# EasyEDA Pro project 2022-4T-MNT-1.eprj

# Schematic EDA-TEST1
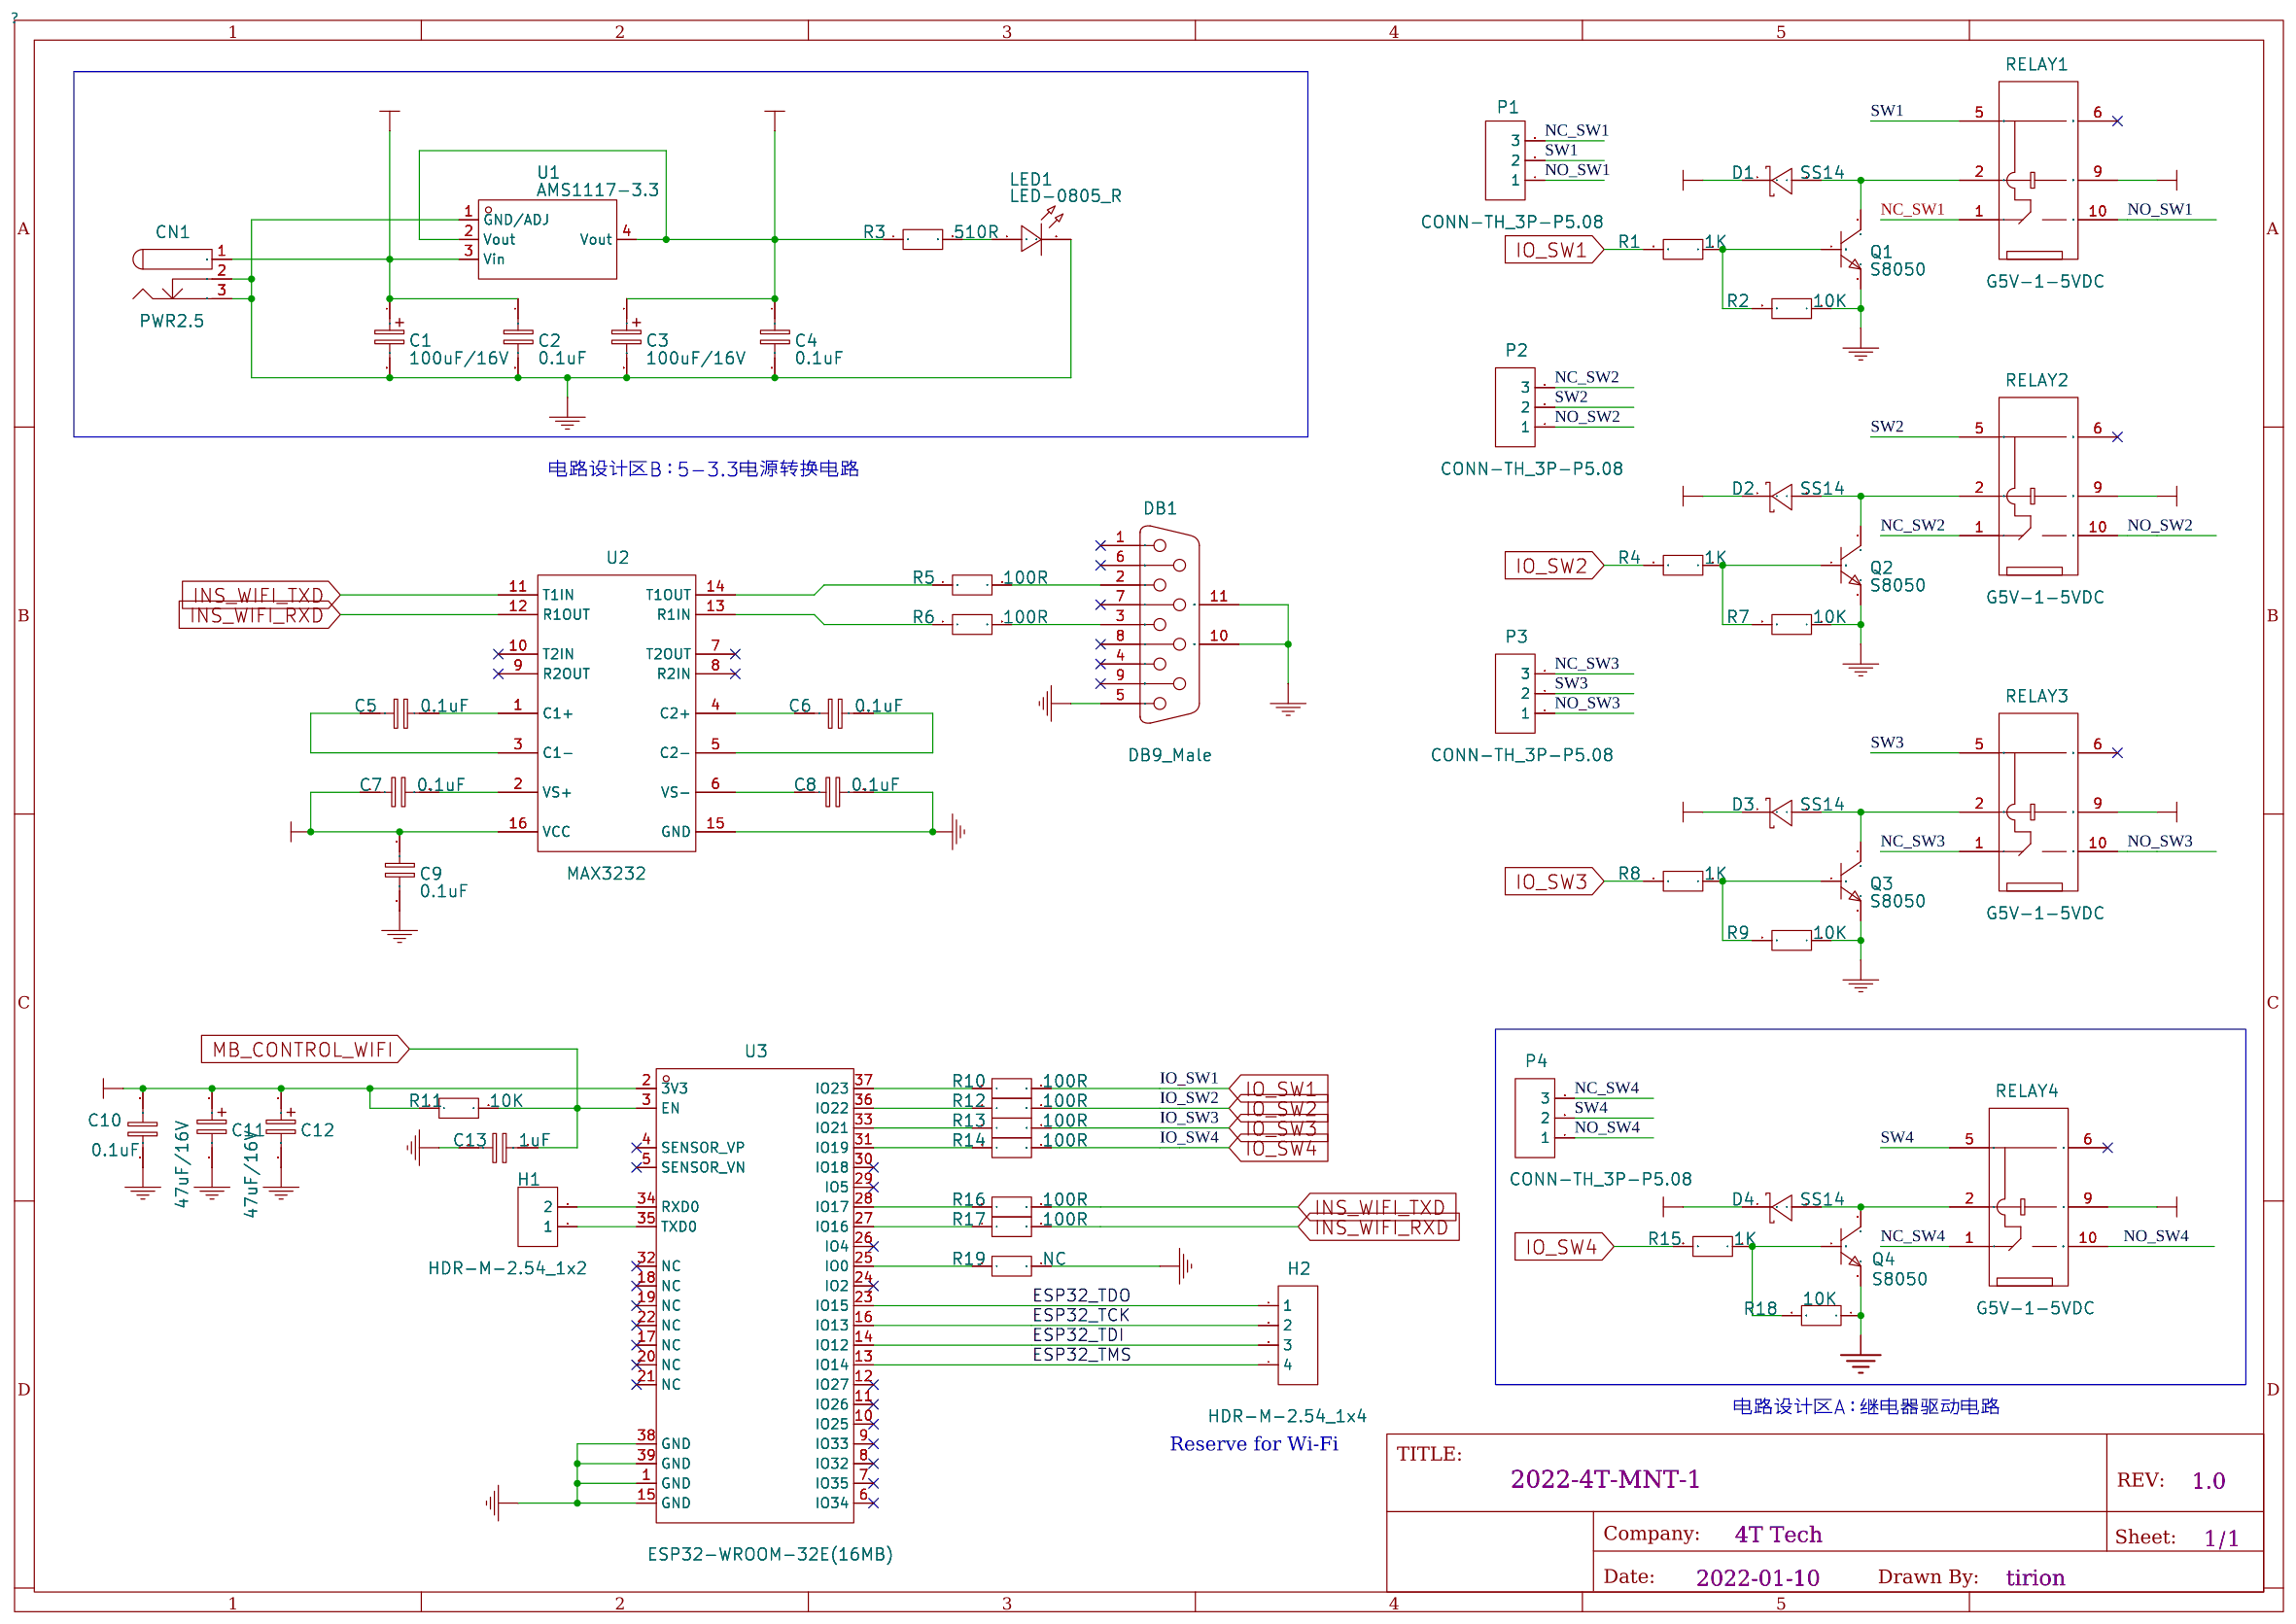
[diagram p0: schematic sheet]

## Parts
C1  100uF/16V  [C_CAP-6*H]
C2  0.1uF  [C0805]
C3  100uF/16V  [C_CAP-6*H]
C4  0.1uF  [C0805]
C5  0.1uF  [C0805]
C6  0.1uF  [C0805]
C7  0.1uF  [C0805]
C8  0.1uF  [C0805]
C9  0.1uF  [C0805]
C10  0.1uF  [C0805]
C11  47uF/16V  [CAP-5X7]
C12  47uF/16V  [CAP-5X7]
C13  1uF  [C0805]
CN1  PWR2.5  [PWR2.5]
D1  SS14  [SMA_L4.4-W2.8-LS5.4-RD]
D2  SS14  [SMA_L4.4-W2.8-LS5.4-RD]
D3  SS14  [SMA_L4.4-W2.8-LS5.4-RD]
D4  SS14  [SMA_L4.4-W2.8-LS5.4-RD]
DB1  DB9_Male  [DSUB-TH_DMR-9P]
H1  HDR-M-2.54_1x2  [HDR-M-2.54_1X2]
H2  HDR-M-2.54_1x4  [HDR-M-2.54_1X4]
LED1  LED-0805_R  [LED0805_RED]
P1  CONN-TH_3P-P5.08  [CONN-TH_3P-P5.08]
P2  CONN-TH_3P-P5.08  [CONN-TH_3P-P5.08]
P3  CONN-TH_3P-P5.08  [CONN-TH_3P-P5.08]
P4  CONN-TH_3P-P5.08  [CONN-TH_3P-P5.08]
Q1  S8050  [SOT-23-3_L2.9-W1.3-P1.90-LS2.4-BR]
Q2  S8050  [SOT-23-3_L2.9-W1.3-P1.90-LS2.4-BR]
Q3  S8050  [SOT-23-3_L2.9-W1.3-P1.90-LS2.4-BR]
Q4  S8050  [SOT-23-3_L2.9-W1.3-P1.90-LS2.4-BR]
R1  1K  [R0805]
R2  10K  [R0805]
R3  510R  [R0805]
R4  1K  [R0805]
R5  100R  [R0805]
R6  100R  [R0805]
R7  10K  [R0805]
R8  1K  [R0805]
R9  10K  [R0805]
R10  100R  [R0805]
R11  10K  [R0805]
R12  100R  [R0805]
R13  100R  [R0805]
R14  100R  [R0805]
R15  1K  [R0805]
R16  100R  [R0805]
R17  100R  [R0805]
R18  10K  [R0805]
R19  NC  [R0805]
RELAY1  G5V-1-5VDC  [RELAY-TH_G5V-1]
RELAY2  G5V-1-5VDC  [RELAY-TH_G5V-1]
RELAY3  G5V-1-5VDC  [RELAY-TH_G5V-1]
RELAY4  G5V-1-5VDC  [RELAY-TH_G5V-1]
U1  AMS1117-3.3  [SOP-SOT-223]
U2  MAX3232  [SOIC-16_150MIL]
U3  ESP32-WROOM-32E(16MB)  [WIFI-SMD_ESP32-WROOM-32E]

## Library data of the parts
C1 C3 = 100uF/16V
C2 C4-C10 = 0.1uF
C11 C12 = 47uF/16V
C13 = 1uF
CN1 = PWR2.5
D1-D4 = SS14: Supplier: LCSC; Manufacturer: MDD; Supplier Part: C2480; JLCPCB Part Class: Basic Part
DB1 = DB9_Male: Supplier Part: C185657; Supplier: LCSC; Manufacturer: Amphenol
H1 = HDR-M-2.54_1x2: Supplier Part: C124375; Supplier: LCSC
H2 = HDR-M-2.54_1x4: Supplier Part: C124378; Supplier: LCSC
LED1 = 17-21SURC/S530-A3/TR8: Manufacturer: EVERLIGHT(台湾亿光); Supplier Part: C72037
P1-P4 = CONN-TH_3P-P5.08: Supplier: LCSC
Q1-Q4 = S8050: Supplier: LCSC; Supplier Part: C916390; Manufacturer: JSMSEMI; JLCPCB Part Class: Extended Part
R1 R4 R8 R15 = 1K
R2 R7 R9 R11 R18 = 10K
R3 = 510R
R5 R6 R10 R12-R14 R16 R17 = 100R
R19 = NC
RELAY1-RELAY4 = G5V-1-5VDC: Supplier: LCSC; Manufacturer: OMRON; Supplier Part: C28695; JLCPCB Part Class: Extended Part
U1 = AMS1117-3.3: Supplier: LCSC; Manufacturer: AMS; image: //image.lceda.cn/szlcsc/C6186.jpg; Supplier Part: C6186; JLCPCB Part Class: Basic; JLCPCB SMD: Yes
U2 = MAX3232: Supplier: LCSC; Manufacturer: TI; JLCPCB Part Class: Extend
U3 = ESP32-WROOM-32E(16MB): Supplier: LCSC; Supplier Part: C701343; Manufacturer: Espressif Systems; JLCPCB Part Class: Extended Part

## Nets
+3V3: C3.1 C4.1 C7.1 C9.1 C10.2 C11.1 C12.1 R3.1 R11.1 U1.2(Vout) U1.4(Vout) U2.16(VCC) U3.2(3V3)
+5V: C1.1 C2.1 CN1.1(ADJ) D1.1(K) D2.1(K) D3.1(K) D4.1(K) RELAY1.9 RELAY2.9 RELAY3.9 RELAY4.9 U1.3(Vin)
GND: C1.2 C2.2 C3.2 C4.2 C8.2 C9.2 C10.1 C11.2 C12.2 C13.2 CN1.2(ADJ) CN1.3(ADJ) DB1.5 DB1.10(MH1) DB1.11(MH2) LED1.2 Q1.2(E) Q2.2(E) Q3.2(E) Q4.2(E) R2.1 R7.1 R9.1 R18.1 R19.2 U1.1(GND/ADJ) U2.15(GND) U3.1(GND) U3.15(GND) U3.38(GND) U3.39(GND)
ESP32_TCK: H2.2 U3.16(IO13)
ESP32_TDI: H2.3 U3.14(IO12)
ESP32_TDO: H2.1 U3.23(IO15)
ESP32_TMS: H2.4 U3.13(IO14)
INS_WIFI_RXD: R17.2 U2.12(R1OUT)
INS_WIFI_TXD: R16.2 U2.11(T1IN)
IO_SW1: R1.2 R10.2
IO_SW2: R4.2 R12.2
IO_SW3: R8.2 R13.2
IO_SW4: R14.2 R15.2
MB_CONTROL_WIFI: C13.1 R11.2 U3.3(EN)
NC_SW1: P1.3 RELAY1.1
NC_SW2: P2.3 RELAY2.1
NC_SW3: P3.3 RELAY3.1
NC_SW4: P4.3 RELAY4.1
NO_SW1: P1.1 RELAY1.10
NO_SW2: P2.1 RELAY2.10
NO_SW3: P3.1 RELAY3.10
NO_SW4: P4.1 RELAY4.10
SW1: P1.2 RELAY1.5
SW2: P2.2 RELAY2.5
SW3: P3.2 RELAY3.5
SW4: P4.2 RELAY4.5
$1N65: R19.1 U3.25(IO0)
$1N108: H1.1 U3.35(TXD0)
$1N109: H1.2 U3.34(RXD0)
$1N160: D1.2(A) Q1.3(C) RELAY1.2
$1N192: Q1.1(B) R1.1 R2.2
$1N267: R10.1 U3.37(IO23)
$1N268: R12.1 U3.36(IO22)
$1N269: R13.1 U3.33(IO21)
$1N270: R14.1 U3.31(IO19)
$1N321: D2.2(A) Q2.3(C) RELAY2.2
$1N337: Q2.1(B) R4.1 R7.2
$1N397: D3.2(A) Q3.3(C) RELAY3.2
$1N413: Q3.1(B) R8.1 R9.2
$1N473: C5.1 U2.1(C1+)
$1N474: C5.2 U2.3(C1-)
$1N484: C6.2 U2.4(C2+)
$1N485: C6.1 U2.5(C2-)
$1N486: R16.1 U3.28(IO17)
$1N487: R17.1 U3.27(IO16)
$1N538: C7.2 U2.2(VS+)
$1N554: C8.1 U2.6(VS-)
$1N573: DB1.2 R5.2
$1N574: DB1.3 R6.2
$1N575: R5.1 U2.14(T1OUT)
$1N576: R6.1 U2.13(R1IN)
$1N1782: D4.2(A) Q4.3(C) RELAY4.2
$1N1818: Q4.1(B) R15.1 R18.2
$1N1835: LED1.1 R3.2

Not connected (* = marked no-connect by the designer): DB1 1* 4* 6* 7* 8* 9*; RELAY1 6*; RELAY2 6*; RELAY3 6*; RELAY4 6*; U2 7(T2OUT)* 8(R2IN)* 9(R2OUT)* 10(T2IN)*; U3 4(SENSOR_VP)* 5(SENSOR_VN)* 6(IO34)* 7(IO35)* 8(IO32)* 9(IO33)* 10(IO25)* 11(IO26)* 12(IO27)* 17(NC)* 18(NC)* 19(NC)* 20(NC)* 21(NC)* 22(NC)* 24(IO2)* 26(IO4)* 29(IO5)* 30(IO18)* 32(NC)*

## Notes on the sheet
- 电路设计区B：5-3.3电源转换电路
- 电路设计区A：继电器驱动电路
- Reserve for Wi-Fi

# Board PCB1
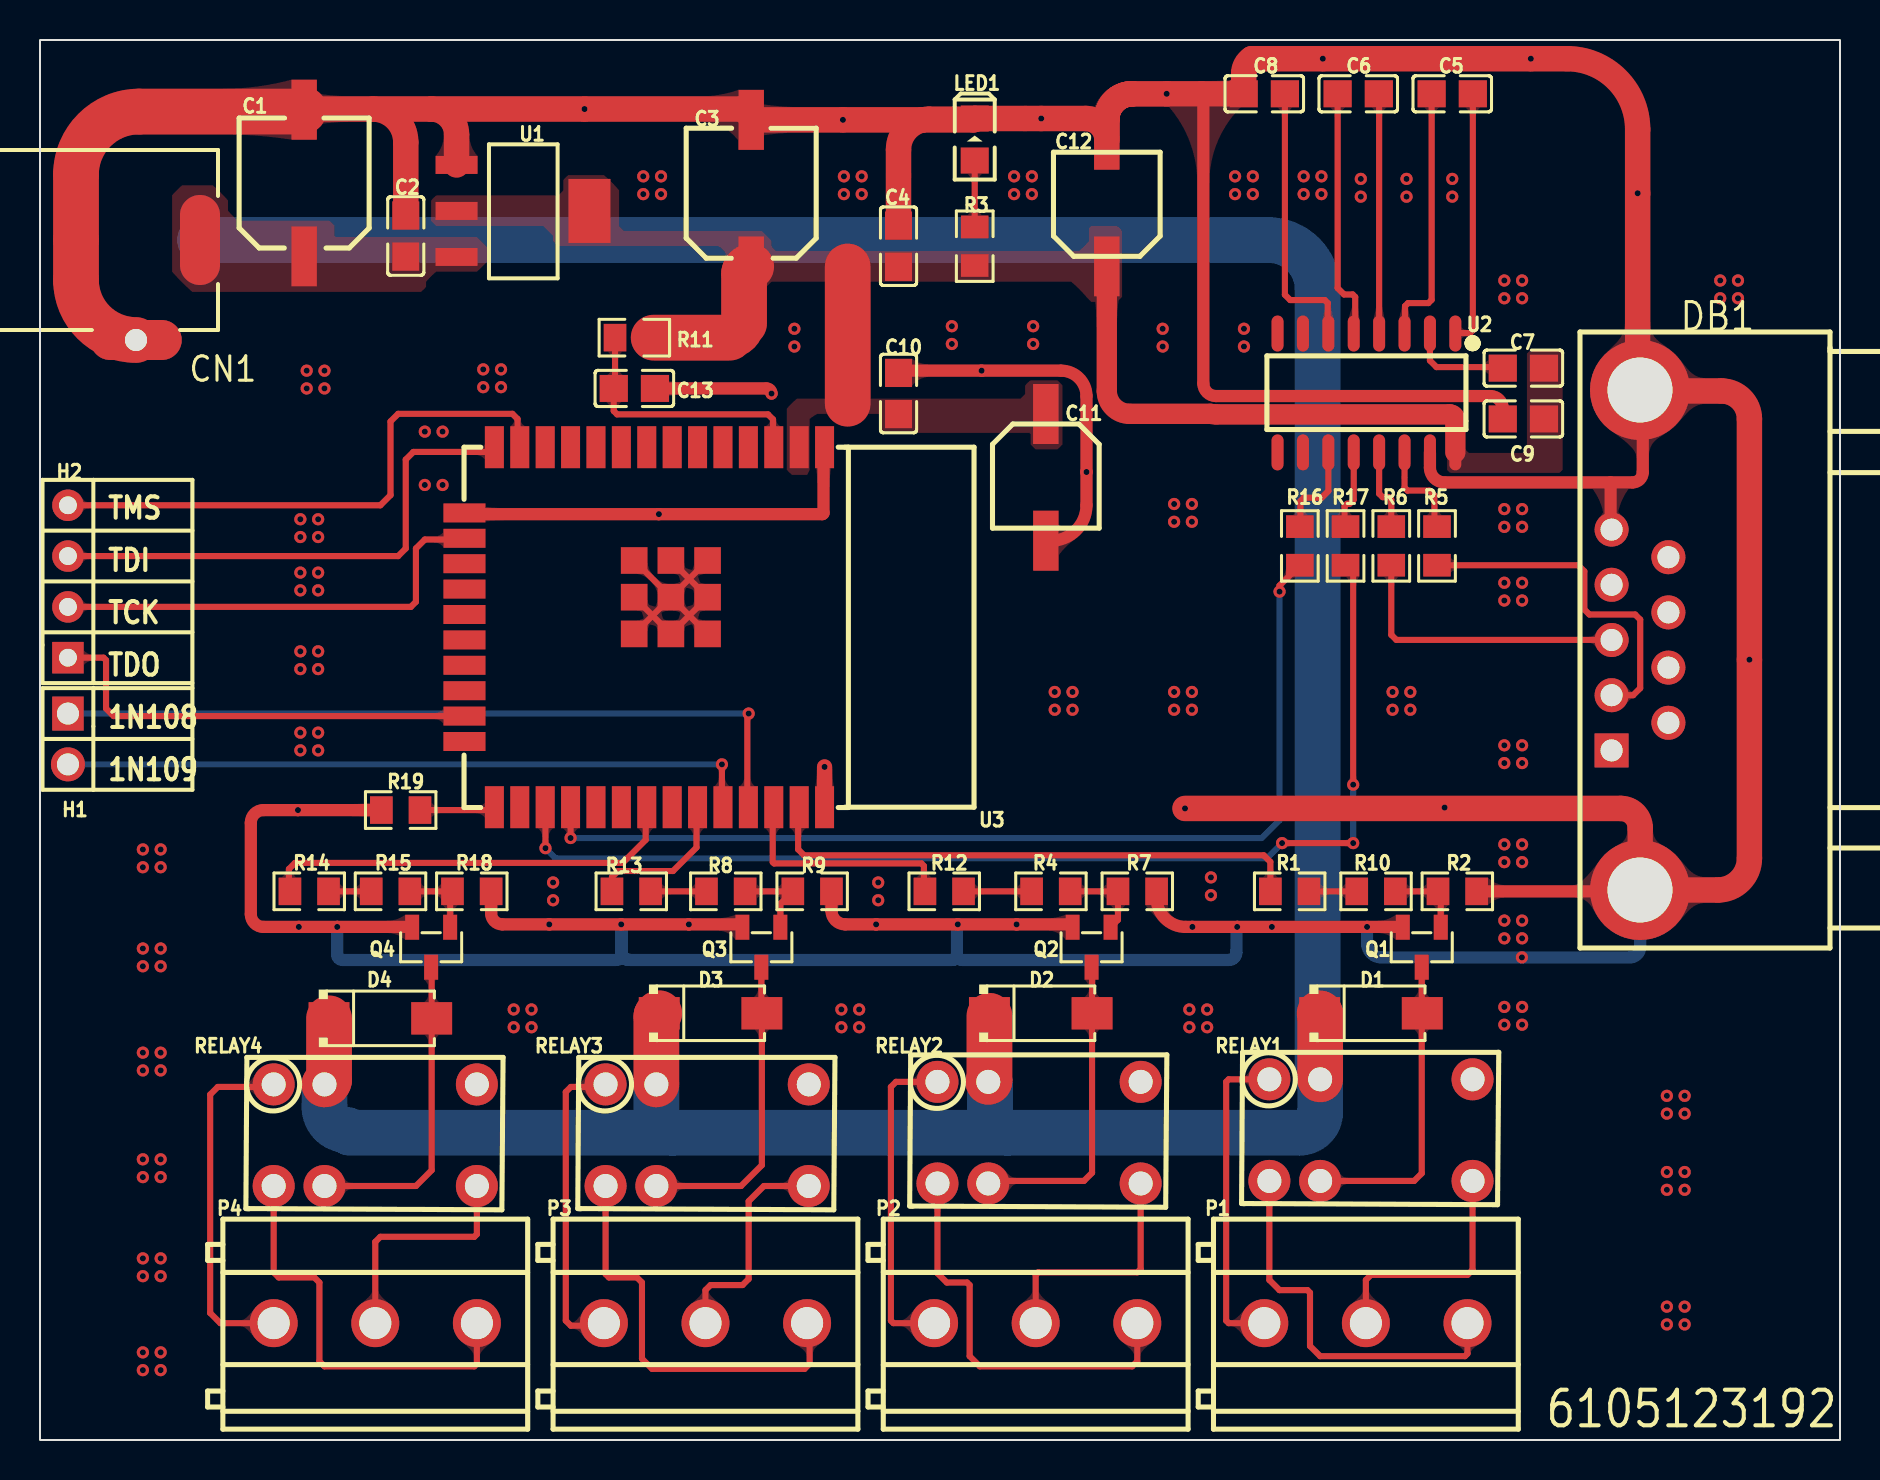
[diagram p1: board, top side]
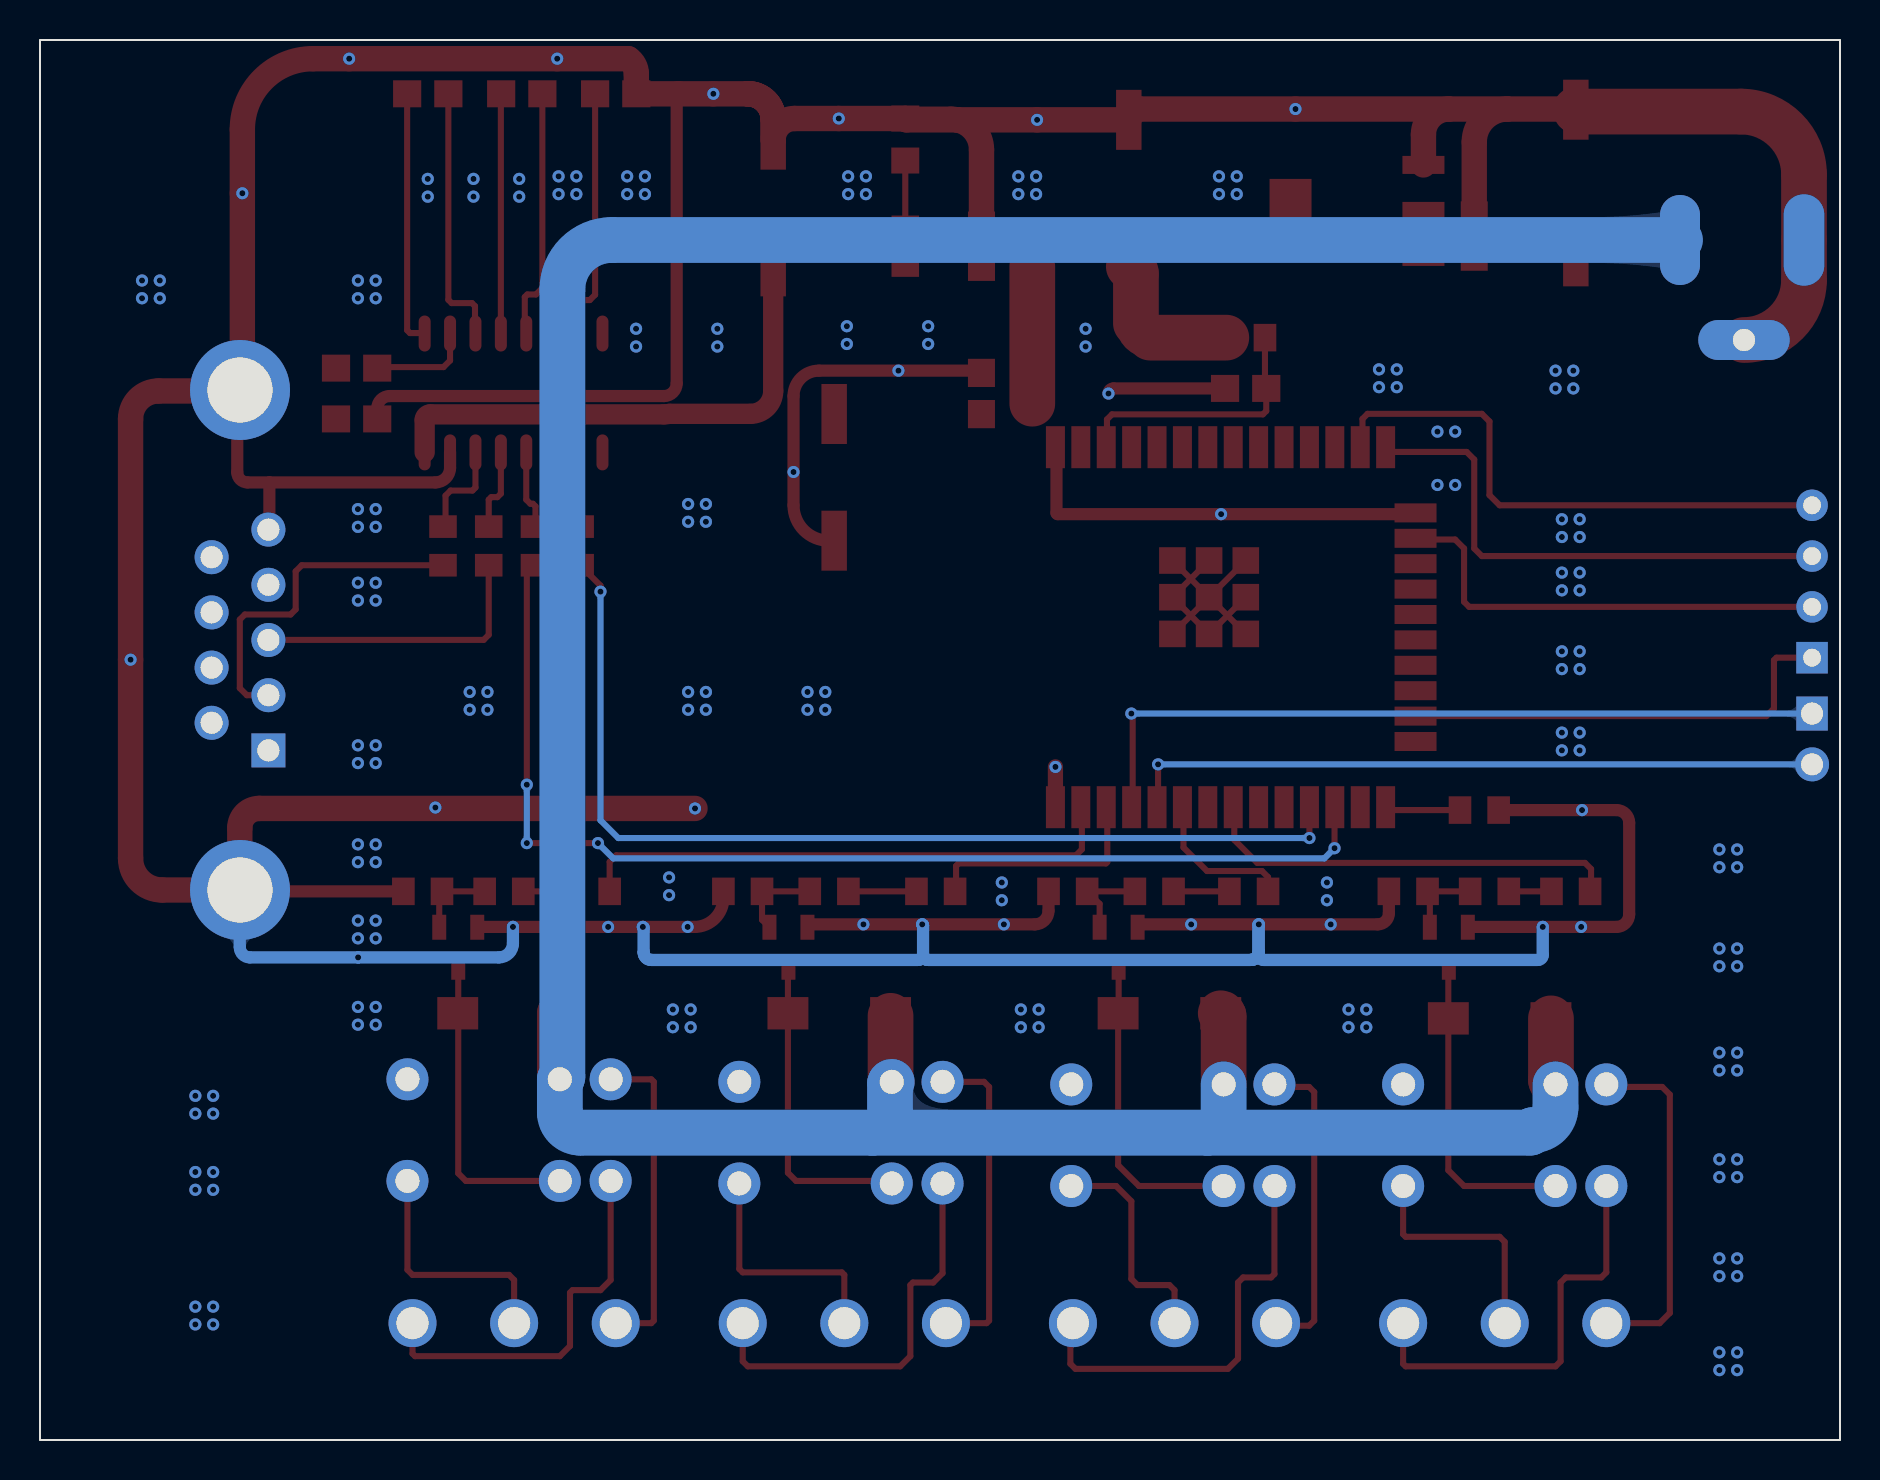
[diagram p2: board, bottom side, seen from below]

Outline 90 x 70 mm; copper layers: Top Layer, Bottom Layer. Coordinates in mm from the lower left corner of the outline.
Outline path: rectangle 0,70 90,0
Stack: Top Layer 0.035mm / Dielectric1 1.51mm FR4 er 4.5 / Bottom Layer 0.035mm

## Design rules (mm)
template: 自定义配置
spacing copperThickness1oz (default): track to track 0.102, other pairs 0.152 to 0.3
spacing copperThickness2oz: track to track 0.203, other pairs 0.152 to 0.3
track width copperThickness1oz (default): min 0.254, default 0.305, max 2.54
track width copperThickness2oz: min 0.254, default 0.305, max 2.54
track width PWR: min 0.305, default 0.61, max 2.54
differential pair differentialPair (default): width min 0.127, default 0.254, max 2.54; gap min 0.152, default 0.152
via viaSize (default): diameter min 0.5, default 0.61, max 10; hole min 0.3, default 0.305, max 6.299
net GND uses PWR
net +3V3 uses PWR
net +5V uses PWR

## Placement (name value [footprint] x y rotation side)
C1  100uF/16V  [C_CAP-6*H]  13.21 59.18 90 top
C2  0.1uF  [C0805]  18.29 60.2 90 top
C3  100uF/16V  [C_CAP-6*H]  35.56 58.67 90 top
C4  0.1uF  [C0805]  42.93 59.69 90 top
C5  0.1uF  [C0805]  70.61 67.31 180 top
C6  0.1uF  [C0805]  65.91 67.31 0 top
C7  0.1uF  [C0805]  74.17 53.59 180 top
C8  0.1uF  [C0805]  61.21 67.31 180 top
C9  0.1uF  [C0805]  74.17 51.05 180 top
C10  0.1uF  [C0805]  42.93 52.32 270 top
C11  47uF/16V  [CAP-5X7]  50.29 50.8 270 top
C12  47uF/16V  [CAP-5X7]  53.34 59.18 90 top
C13  1uF  [C0805]  29.72 52.58 0 top
CN1  -  [PWR2.5]  8 60 0 top
D1  SS14  [SMA_L4.4-W2.8-LS5.4-RD]  66.55 21.34 0 top
D2  SS14  [SMA_L4.4-W2.8-LS5.4-RD]  50.04 21.34 0 top
D3  SS14  [SMA_L4.4-W2.8-LS5.4-RD]  33.53 21.34 0 top
D4  SS14  [SMA_L4.4-W2.8-LS5.4-RD]  17.02 21.08 0 top
DB1  DB9_Male  [DSUB-TH_DMR-9P]  80 40 0 top
H1  HDR-M-2.54_1x2  [HDR-M-2.54_1X2]  1.4 35.05 270 top
H2  HDR-M-2.54_1x4  [HDR-M-2.54_1X4]  1.4 42.93 90 top
LED1  LED-0805_R  [LED0805_RED]  46.74 65.02 90 top
P1  -  [CONN-TH_3P-P5.08]  66.29 5.84 0 top
P2  -  [CONN-TH_3P-P5.08]  49.78 5.84 0 top
P3  -  [CONN-TH_3P-P5.08]  33.27 5.84 0 top
P4  -  [CONN-TH_3P-P5.08]  16.76 5.84 0 top
Q1  S8050  [SOT-23-3_L2.9-W1.3-P1.90-LS2.4-BR]  69.09 24.64 90 top
Q2  S8050  [SOT-23-3_L2.9-W1.3-P1.90-LS2.4-BR]  52.58 24.64 90 top
Q3  S8050  [SOT-23-3_L2.9-W1.3-P1.90-LS2.4-BR]  36.07 24.64 90 top
Q4  S8050  [SOT-23-3_L2.9-W1.3-P1.90-LS2.4-BR]  19.56 24.64 90 top
R1  1K  [R0805]  66.8 27.43 180 top
R2  10K  [R0805]  70.87 27.43 180 top
R3  510R  [R0805]  46.74 59.69 90 top
R4  1K  [R0805]  50.55 27.43 180 top
R5  100R  [R0805]  69.85 44.7 270 top
R6  100R  [R0805]  67.56 44.7 270 top
R7  10K  [R0805]  54.86 27.43 180 top
R8  1K  [R0805]  34.29 27.43 180 top
R9  10K  [R0805]  38.61 27.43 180 top
R10  100R  [R0805]  62.48 27.43 0 top
R11  10K  [R0805]  29.72 55.12 180 top
R12  100R  [R0805]  45.21 27.43 0 top
R13  100R  [R0805]  29.56 27.43 0 top
R14  100R  [R0805]  13.46 27.43 0 top
R15  1K  [R0805]  17.53 27.43 180 top
R16  100R  [R0805]  62.99 44.7 90 top
R17  100R  [R0805]  65.28 44.7 90 top
R18  10K  [R0805]  21.59 27.43 180 top
R19  NC  [R0805]  18.03 31.5 180 top
RELAY1  G5V-1-5VDC  [RELAY-TH_G5V-1]  66.55 15.49 0 top
RELAY2  G5V-1-5VDC  [RELAY-TH_G5V-1]  49.95 15.37 0 top
RELAY3  G5V-1-5VDC  [RELAY-TH_G5V-1]  33.36 15.24 0 top
RELAY4  G5V-1-5VDC  [RELAY-TH_G5V-1]  16.76 15.24 0 top
U1  AMS1117-3.3  [SOP-SOT-223]  20.83 63.75 0 top
U2  MAX3232  [SOIC-16_150MIL]  66.32 52.35 180 top
U3  ESP32-WROOM-32E(16MB)  [WIFI-SMD_ESP32-WROOM-32E]  30.23 40.64 180 top

## Footprints (pads in the part's own frame, mm; a bottom-side part is the same pattern mirrored in y, then rotated)
C0805
  rect 1.41x1.35 smd: 1(-1.03,0.001) 2(1.03,0.001)
C_CAP-6*H
  rect 3x1.274 smd: 1(-0.001,0.001) 2(7.333,0.001)
CAP-5X7
  rect 3x1.274 smd: 1(-0.5,0) 2(5.834,0)
CONN-TH_3P-P5.08
  round 2.4 hole 1.6: 1(-5.08,0) 2(0,0) 3(5.08,0)
DSUB-TH_DMR-9P
  rect 1.7x1.7 hole 1.1: 1(-1.42,-5.52)
  round 1.7 hole 1.1: 2(-1.42,-2.76) 3(-1.42,0) 4(-1.42,2.76) 5(-1.42,5.52) 6(1.42,-4.14) 7(1.42,-1.38) 8(1.42,1.38) 9(1.42,4.14)
  round 5 hole 3.25: 10(0,12.5) 11(0,-12.5)
HDR-M-2.54_1X2
  rect 1.7x1.575 hole 1.1: 1(-1.27,0)
  round 1.7 hole 1.1: 2(1.27,0)
HDR-M-2.54_1X4
  rect 1.575x1.575 hole 0.889: 1(-3.81,0)
  round 1.575 hole 0.889: 2(-1.27,0) 3(1.27,0) 4(3.81,0)
LED0805_RED
  rect 1.3x1.399 smd: 1(-1.05,0) 2(1.05,0)
PWR2.5
  custom 2x4.5 hole 1.2x1.205: 1(0,0)
  custom 2.032x4.572 hole 1.2x1.205: 2(-6.2,0)
  oval 4.572x2 hole 1.105x1.1: 3(-3.2,-5)
R0805
  rect 1.133x1.377 smd: 1(-0.966,0) 2(0.966,0)
RELAY-TH_G5V-1
  round 2.1 hole 1.2: 1(-5.08,-2.54) 2(-2.54,-2.54) 5(5.08,-2.54) 6(5.08,2.54) 9(-2.54,2.54) 10(-5.08,2.54)
SMA_L4.4-W2.8-LS5.4-RD
  rect 2.046x1.62 smd: 1(-2.566,0) 2(2.566,0)
SOIC-16_150MIL
  oval 0.6x1.8 smd: 1(-4.445,-2.972) 2(-3.175,-2.972) 3(-1.905,-2.972) 4(-0.635,-2.972) 5(0.635,-2.972) 6(1.905,-2.972) 7(3.175,-2.972) 8(4.445,-2.972) 9(4.445,2.972) 10(3.175,2.972) 11(1.905,2.972) 12(0.635,2.972) 13(-0.635,2.972) 14(-1.905,2.972) 15(-3.175,2.972) 16(-4.445,2.972)
SOP-SOT-223
  rect 2.1x0.9 smd: 1(0,0) 2(0,-2.3) 3(0,-4.6)
  rect 2.1x3.2 smd: 4(6.644,-2.3)
SOT-23-3_L2.9-W1.3-P1.90-LS2.4-BR
  rect 1.25x0.7 smd: 1(1,-0.95) 2(1,0.95) 3(-1,0)
WIFI-SMD_ESP32-WROOM-32E
  rect 0.95x2.1 smd: 1(-9.002,-9) 2(-7.732,-9) 3(-6.463,-9) 4(-5.192,-9) 5(-3.922,-9) 6(-2.652,-9) 7(-1.383,-9) 8(-0.113,-9) 9(1.157,-9) 10(2.428,-9) 11(3.697,-9) 12(4.968,-9) 13(6.237,-9) 14(7.508,-9) 25(7.508,9) 26(6.237,9) 27(4.968,9) 28(3.697,9) 29(2.428,9) 30(1.157,9) 31(-0.113,9) 32(-1.383,9) 33(-2.652,9) 34(-3.922,9) 35(-5.192,9) 36(-6.463,9) 37(-7.732,9) 38(-9.002,9)
  rect 2.1x0.95 smd: 15(9.002,-5.715) 16(9.002,-4.445) 17(9.002,-3.175) 18(9.002,-1.905) 19(9.002,-0.635) 20(9.002,0.635) 21(9.002,1.905) 22(9.002,3.175) 23(9.002,4.445) 24(9.002,5.715)
  rect 1.33x1.33 smd: 39(-1.319,-1.5) 40(-1.319,-3.334) 41(-1.319,0.335) 42(-3.154,0.335) 43(-3.154,-1.5) 44(-3.154,-3.334) 45(0.516,-3.334) 46(0.516,-1.5) 47(0.516,0.335)

## Nets
As in the schematic, except:
GND: C1.2 C2.2 C3.2 C4.2 C8.2 C9.2 C10.1 C11.2 C12.2 C13.2 CN1.2 CN1.3 DB1.5 DB1.10 DB1.11 LED1.2 Q1.2 Q2.2 Q3.2 Q4.2 R2.1 R7.1 R9.1 R18.1 R19.2 U1.1 U2.15 U3.1 U3.15 U3.38 U3.39 U3.40 U3.41 U3.42 U3.43 U3.44 U3.45 U3.46 U3.47

Pads without a net: DB1 1 4 6 7 8 9; RELAY1 6; RELAY2 6; RELAY3 6; RELAY4 6; U2 7 8 9 10; U3 4 5 6 7 8 9 10 11 12 17 18 19 20 21 22 24 26 29 30 32

## Via types
v1: diameter 0.61, hole 0.305, Top Layer to Bottom Layer, 203 vias

## Routing (per net, layer and track width the routed paths; a pad name or vN(x,y) marks a point on that pad's centre or on a via; arc(x,y) is an arc through that point)
+3V3: length 40.9
  Top Layer w1.016: U2.16 70.77,51 arc(70.68,51.2) 70.49,51.28 58.8,51.28 arc(58.66,51.29) 58.52,51.31 54.48,51.31 arc(53.67,51.64) 53.34,52.45 C12.1
  Top Layer w2.032: 34.49,55.12 arc(35,55.33) 35.2,55.83
  Top Layer w2.286: 35.2,55.83 35.2,58.32 arc(35.31,58.57) C3.1 ; R11.1 34.49,55.12 ; 40.39,58.67 40.39,51.82
+5V: length 170.4
  Top Layer w2.286: 47.47,21.21 47.47,17.97 arc(47.46,17.92) RELAY2.9 ; RELAY1.9 64.01,21.31 arc(64,21.33) D1.1 ; RELAY3.9 30.82,21.19 arc(30.86,21.29) D3.1 ; D4.1 14.45,18.01 arc(14.39,17.85) RELAY4.9
  Bottom Layer w2.286: CN1.1 61.41,60 arc(63.16,59.28) 63.88,57.53 63.88,18.16 arc(63.92,18.07) RELAY1.9 64.01,16.38 arc(63.71,15.66) 62.99,15.37 48.39,15.37 ; 48.39,15.37 31.62,15.37 ; 48.39,15.37 arc(47.76,15.63) 47.5,16.26 47.5,17.82 arc(47.47,17.88) RELAY2.9 ; 31.62,15.37 15.49,15.37 arc(15.4,15.4) 15.37,15.49 arc(14.56,15.83) 14.22,16.64 RELAY4.9 ; 31.62,15.37 arc(31.05,15.6) 30.82,16.17 RELAY3.9
GND: length 456.5
  Top Layer w0.305: 32.46,41.22 33.38,40.3 ; 32.46,41.22 U3.41 ; 32.46,41.22 U3.39 ; 32.46,41.22 U3.43 32.46,43.06 ; U3.39 U3.45 ; U3.39 32.46,43.06 ; U3.39 30.63,41.22 ; 32.46,43.06 U3.44 ; 32.46,43.06 U3.40 ; 30.63,41.22 U3.46 ; 30.63,41.22 31.54,40.3 ; 30.63,41.22 29.71,40.3
  Top Layer w0.61: C11.2 50.55,44.97 arc(51.81,45.48) 52.32,46.74 v1(52.32,48.4) 52.32,52.2 arc(51.95,53.1) 51.05,53.47 v1(47.08,53.47) 43.04,53.47 arc(42.96,53.43) C10.1 ; 39.18,49.58 39.18,46.35 arc(39.16,46.31) 39.12,46.29 v1(30.94,46.29) 21.17,46.29 ; R18.1 22.56,26.34 arc(22.72,25.94) 23.11,25.78 v1(25.46,25.78) v1(29.06,25.78) v1(32.44,25.78) 34.97,25.78 arc(35.08,25.74) Q3.2 ; R19.2 v1(12.9,31.5) 11.18,31.5 arc(10.73,31.31) 10.54,30.86 10.54,26.29 arc(10.73,25.84) 11.18,25.65 v1(12.94,25.65) v1(14.86,25.65) 18.59,25.65 arc(18.6,25.65) Q4.2 ; R9.1 39.57,26.47 arc(39.77,25.98) 40.26,25.78 v1(41.81,25.78) v1(45.89,25.78) v1(48.83,25.78) 51.49,25.78 arc(51.59,25.74) Q2.2 ; U2.15 69.5,48.61 arc(69.71,48.09) 70.23,47.88 78.53,47.88 ; R7.1 55.83,27.1 arc(56.25,26.08) 57.28,25.65 v1(57.62,25.65) v1(59.86,25.65) v1(61.59,25.65) v1(66.35,25.65) 68.12,25.65 arc(68.13,25.65) Q1.2 ; 78.53,47.88 79.63,47.88 arc(79.99,48.03) 80.14,48.39 80.14,52.36 arc(80.13,52.41) 80.1,52.45 ; 78.53,47.88 78.53,45.57 arc(78.54,45.53) DB1.5 ; C13.2 36.32,52.58 arc(36.5,52.5) v1(36.58,52.32) ; R2.1 79.93,27.43 arc(79.98,27.45) DB1.11 ; C9.2 73.14,51.58 arc(72.96,52.01) 72.52,52.2 58.8,52.2 arc(58.35,52.38) 58.17,52.83 58.17,67.21 arc(58.14,67.28) 58.07,67.31
  Top Layer w0.762: U3.38 v1(39.23,33.66)
  Top Layer w1.27: 54.61,67.31 v1(56.33,67.31) C8.2 60.18,68.31 arc(60.29,68.74) 60.59,69.07 v1(64.14,69.07) v1(74.54,69.07) 76.35,69.07 arc(78.85,68.03) 79.88,65.53 v1(79.88,62.34) 79.88,52.62 arc(79.92,52.53) DB1.10 arc(80.01,52.47) 80.05,52.45 84.07,52.45 arc(85.06,52.04) 85.47,51.05 v1(85.47,39.02) 85.47,29.08 arc(85.01,27.96) 83.89,27.5 DB1.11 arc(80.01,27.5) 80.01,27.51 80.01,30.61 arc(79.73,31.29) 79.04,31.58 v1(57.25,31.58) ; 54.61,67.31 arc(53.71,66.94) 53.34,66.04 ; 54.61,67.31 arc(53.71,66.94) 53.34,66.04 ; 54.61,67.31 arc(53.71,66.94) 53.34,66.04 ; 54.61,67.31 arc(53.71,66.94) 53.34,66.04 ; 54.61,67.31 arc(53.71,66.94) 53.34,66.04 ; 19.56,66.55 v1(27.23,66.55) 35.02,66.55 arc(35.4,66.39) C3.2 v1(40.15,66.01) 44.14,66.01 ; 19.56,66.55 16.64,66.55 ; 19.56,66.55 arc(20.46,66.18) 20.83,65.28 U1.1 ; 16.64,66.55 13.24,66.55 arc(13.22,66.54) C1.2 ; 16.64,66.55 arc(17.8,66.06) 18.29,64.9 C2.2 ; C4.2 42.93,64.52 arc(43.27,65.48) 44.14,66.01 ; 44.14,66.01 46.67,66.01 arc(46.72,66.03) LED1.2 ; 44.14,66.01 arc(44.29,66.03) 44.45,66.04 46.7,66.04 arc(46.73,66.05) LED1.2 ; 53.34,66.04 C12.2 arc(53.03,65.76) 52.28,66.07 v1(50.06,66.07) LED1.2
  Top Layer w2.286: CN1.3 arc(2.68,55.88) 1.8,58 CN1.2 1.8,63.27 arc(2.72,65.5) 4.95,66.42 13.11,66.42 arc(13.18,66.45) C1.2
  Bottom Layer w0.61: v1(14.86,25.65) 14.86,24.25 arc(14.93,24.08) 15.11,24 28.83,24 arc(29.01,24.08) 29.08,24.26 29.08,24.28 ; 29.46,24 45.59,24 ; 29.46,24 arc(29.23,24.08) 29.08,24.28 ; 29.46,24 arc(29.23,24.08) 29.08,24.28 ; 29.46,24 arc(29.23,24.08) 29.08,24.28 ; 29.46,24 arc(29.23,24.08) 29.08,24.28 ; 45.59,24 arc(45.77,24.08) 45.85,24.26 ; 45.59,24 arc(45.77,24.08) 45.85,24.26 ; 45.59,24 arc(45.77,24.08) 45.85,24.26 ; 45.59,24 arc(45.77,24.08) 45.85,24.26 ; 45.85,24.26 45.85,25.74 ; 45.85,24.26 arc(45.92,24.08) 46.1,24 ; 45.85,24.26 arc(45.92,24.08) 46.1,24 ; 45.85,25.74 arc(45.86,25.77) v1(45.89,25.78) arc(45.86,25.77) 45.85,25.74 ; 29.08,24.28 29.08,25.76 arc(29.08,25.77) v1(29.06,25.78) 29.06,24.41 ; 29.08,24.28 arc(29.07,24.34) 29.06,24.41 ; 29.08,24.28 arc(29.07,24.34) 29.06,24.41 ; 29.08,24.28 arc(29.07,24.34) 29.06,24.41 ; 29.08,24.28 arc(29.07,24.34) 29.06,24.41 ; 46.1,24 59.44,24 ; 59.44,24 arc(59.71,24.11) 59.82,24.38 ; 59.44,24 arc(59.71,24.11) 59.82,24.38 ; v1(66.35,25.65) 66.35,24.83 arc(66.56,24.34) 67.06,24.13 v1(74.09,24.13) 79.5,24.13 arc(79.86,24.28) 80.01,24.64 80.01,27.49 arc(80.01,27.5) DB1.11 ; 59.82,24.38 59.82,25.61 arc(59.83,25.64) v1(59.86,25.65)
  vias: v1(5.14,29.53) v1(5.14,28.64) v1(5.14,24.57) v1(5.14,23.69) v1(5.14,19.37) v1(5.14,18.48) v1(5.14,14.03) v1(5.14,13.14) v1(5.14,9.08) v1(5.14,8.19) v1(5.14,4.38) v1(5.14,3.49) v1(6.03,29.53) v1(6.03,28.64) v1(6.03,24.57) v1(6.03,23.69) v1(6.03,19.37) v1(6.03,18.48) v1(6.03,14.03) v1(6.03,13.15) v1(6.03,9.08) v1(6.03,8.19) v1(6.03,4.38) v1(6.03,3.49) v1(13.02,46.04) v1(13.02,45.15) v1(13.02,43.37) v1(13.02,42.48) v1(13.02,39.43) v1(13.02,38.54) v1(13.02,35.37) v1(13.02,34.48) v1(13.33,53.47) v1(13.33,52.58) v1(13.91,46.04) v1(13.91,45.15) v1(13.91,43.37) v1(13.91,42.48) v1(13.91,39.43) v1(13.91,38.55) v1(13.91,35.37) v1(13.91,34.48) v1(14.22,53.47) v1(14.22,52.58) v1(19.24,50.42) v1(19.24,47.75) v1(20.13,50.42) v1(20.13,47.75) v1(22.16,53.53) v1(22.16,52.64) v1(23.05,53.53) v1(23.05,52.64) v1(23.69,21.53) v1(23.69,20.64) v1(24.57,21.53) v1(24.57,20.64) v1(25.65,27.88) v1(25.65,26.99) v1(30.16,63.18) v1(30.16,62.29) v1(31.05,63.18) v1(31.05,62.29) v1(37.72,55.56) v1(37.72,54.67) v1(40.07,21.53) v1(40.07,20.64) v1(40.2,63.18) v1(40.2,62.29) v1(40.96,21.53) v1(40.96,20.64) v1(41.08,63.18) v1(41.08,62.29) v1(41.91,27.88) v1(41.91,26.99) v1(45.59,55.69) v1(45.59,54.8) v1(48.7,63.18) v1(48.7,62.29) v1(49.59,63.18) v1(49.59,62.29) v1(49.66,55.69) v1(49.66,54.8) v1(50.74,37.4) v1(50.74,36.51) v1(51.63,37.4) v1(51.63,36.51) v1(56.13,55.56) v1(56.13,54.67) v1(56.71,46.8) v1(56.71,45.91) v1(56.71,37.4) v1(56.71,36.51) v1(57.47,21.53) v1(57.47,20.64) v1(57.59,46.8) v1(57.59,45.91) v1(57.59,37.4) v1(57.59,36.51) v1(58.36,21.53) v1(58.36,20.64) v1(58.55,28.13) v1(58.55,27.24) v1(59.75,63.18) v1(59.75,62.29) v1(60.2,55.56) v1(60.2,54.67) v1(60.64,63.18) v1(60.64,62.29) v1(63.18,63.18) v1(63.18,62.29) v1(64.07,63.18) v1(64.07,62.29) v1(66.04,63.05) v1(66.04,62.17) v1(67.63,37.4) v1(67.63,36.51) v1(68.33,63.05) v1(68.33,62.17) v1(68.52,37.4) v1(68.52,36.51) v1(70.23,31.62) v1(70.61,63.05) v1(70.61,62.17) v1(73.22,57.98) v1(73.22,57.09) v1(73.22,46.55) v1(73.22,45.66) v1(73.22,42.86) v1(73.22,41.97) v1(73.22,34.73) v1(73.22,33.85) v1(73.22,29.78) v1(73.22,28.89) v1(73.22,25.97) v1(73.22,25.08) v1(73.22,21.65) v1(73.22,20.76) v1(74.1,57.98) v1(74.1,57.09) v1(74.1,46.55) v1(74.1,45.66) v1(74.1,42.86) v1(74.1,41.97) v1(74.1,34.73) v1(74.1,33.85) v1(74.1,29.78) v1(74.1,28.89) v1(74.1,25.97) v1(74.1,25.08) v1(74.1,21.65) v1(74.1,20.77) v1(81.34,17.21) v1(81.34,16.32) v1(81.34,13.4) v1(81.34,12.51) v1(81.34,6.67) v1(81.34,5.78) v1(82.23,17.21) v1(82.23,16.32) v1(82.23,13.4) v1(82.23,12.51) v1(82.23,6.67) v1(82.23,5.78) v1(84.01,57.98) v1(84.01,57.09) v1(84.9,57.98) v1(84.9,57.09)
ESP32_TCK: length 22.9
  Top Layer w0.305: 21.17,45.02 19.24,45.02 18.8,44.58 18.8,41.91 18.54,41.66 1.27,41.66
ESP32_TDI: length 26.2
  Top Layer w0.305: 1.27,44.2 17.91,44.2 18.29,44.58 18.29,49.02 18.67,49.4 22.49,49.4 22.67,49.58
ESP32_TDO: length 22.6
  Top Layer w0.305: 1.27,39.12 3.17,39.12 3.3,38.99 3.3,36.58 3.68,36.19 21.11,36.19 21.17,36.13
ESP32_TMS: length 28.3
  Top Layer w0.305: 1.27,46.74 17.02,46.74 17.53,47.24 17.53,50.93 17.91,51.31 23.62,51.31 23.88,51.05 23.88,49.64 23.94,49.58
INS_WIFI_RXD: length 4
  Top Layer w0.305: R17.2 65.23,45.72 65.23,46.69 65.35,46.81 65.48,46.81 65.69,47.02 U2.12
INS_WIFI_TXD: length 4.8
  Top Layer w0.305: U2.11 64.42,47.45 64.08,47.12 63.19,47.12 63.02,46.94 63.02,45.7 R16.2
IO_SW1: length 2.4
  Top Layer w0.305: R1.2 R10.2
IO_SW2: length 3.4
  Top Layer w0.305: R12.2 R4.2
IO_SW3: length 2.8
  Top Layer w0.305: R8.2 R13.2
IO_SW4: length 2.1
  Top Layer w0.305: R14.2 R15.2
MB_CONTROL_WIFI: length 13.3
  Top Layer w0.305: 36.64,49.58 36.65,49.59 36.65,51.03 36.4,51.28 28.85,51.28 28.69,51.45 C13.1 arc(28.73,52.6) 28.75,52.64 R11.2
NC_SW1: length 19.6
  Top Layer w0.305: RELAY1.1 61.47,8 61.98,7.49 63.37,7.49 63.5,7.37 63.5,4.7 64.01,4.19 71.25,4.19 71.37,4.32 P1.3
NC_SW2: length 20.6
  Top Layer w0.305: P2.3 54.86,3.94 54.61,3.68 46.99,3.68 46.48,4.19 46.48,7.75 46.35,7.87 45.34,7.87 44.87,8.34 44.87,12.95
NC_SW3: length 21
  Top Layer w0.305: P3.3 38.48,5.72 38.48,3.81 38.23,3.56 30.61,3.56 30.1,4.06 30.1,7.87 29.84,8.13 28.45,8.13 28.28,8.3 RELAY3.1
NC_SW4: length 20.8
  Top Layer w0.305: P4.3 21.84,3.81 21.72,3.68 14.22,3.68 13.97,3.94 13.97,7.87 13.72,8.13 11.94,8.13 11.68,8.38 RELAY4.1
NO_SW1: length 16.1
  Top Layer w0.305: P1.1 59.44,5.84 59.31,5.97 59.31,17.91 59.44,18.03 RELAY1.10
NO_SW2: length 16.4
  Top Layer w0.305: P2.1 42.67,5.84 42.54,5.97 42.54,17.65 42.8,17.91 44.75,17.91 44.87,18.03
NO_SW3: length 15.6
  Top Layer w0.305: RELAY3.10 28.15,17.65 26.54,17.65 26.29,17.4 26.29,5.97 26.54,5.72 28.07,5.72 P3.1
NO_SW4: length 17.7
  Top Layer w0.305: P4.1 9.02,5.84 8.51,6.35 8.51,17.27 8.89,17.65 11.56,17.65 RELAY4.10
SW1: length 12.1
  Top Layer w0.305: P1.2 66.29,8 66.55,8.25 71.37,8.25 71.63,8.51 RELAY1.5
SW2: length 12.2
  Top Layer w0.305: P2.2 49.78,8.25 49.91,8.38 54.86,8.38 55.03,8.55 55.03,12.95
SW3: length 11.2
  Top Layer w0.305: RELAY3.5 36.19,12.7 35.43,11.94 35.43,8.05 35.13,7.75 33.53,7.75 33.27,7.49 P3.2
SW4: length 11.7
  Top Layer w0.305: RELAY4.5 21.84,10.29 21.72,10.16 17.02,10.16 16.76,9.91 P4.2
$1N65: length 3.7
  Top Layer w0.305: 22.67,31.58 22.58,31.5 R19.1
$1N108: length 38.9
  Top Layer w0.305: v1(35.43,36.32) 35.37,36.25 35.37,31.58
  Bottom Layer w0.305: v1(35.43,36.32) 1.27,36.32
$1N109: length 35
  Top Layer w0.305: 34.1,31.58 v1(34.1,33.78)
  Bottom Layer w0.305: v1(34.1,33.78) 1.27,33.78
$1N160: length 15.6
  Top Layer w0.305: Q1.3 69.09,21.36 D1.2 69.09,21.31 69.09,13.33 68.71,12.95 RELAY1.2
$1N192: length 4
  Top Layer w0.305: R1.1 R2.2 70.04,27.29 Q1.1
$1N267: length 27.4
  Top Layer w0.305: 37.91,31.58 37.91,29.53 38.2,29.24 61.19,29.24 61.52,28.91 R10.1
$1N268: length 11.6
  Top Layer w0.305: 36.64,31.58 36.64,28.9 36.7,28.83 44.07,28.83 44.2,28.7 44.2,27.48 R12.1
$1N269: length 7.5
  Top Layer w0.305: R13.1 28.6,28.14 28.9,28.45 31.65,28.45 32.83,29.63 32.83,31.58
$1N270: length 21.2
  Top Layer w0.305: R14.1 12.45,27.48 12.45,28.55 12.75,28.85 29.13,28.85 30.29,30.01 30.29,31.58
$1N321: length 15.6
  Top Layer w0.305: Q2.3 52.6,23.61 D2.2 52.6,13.36 52.2,12.95 47.41,12.95
$1N337: length 4.3
  Top Layer w0.305: R4.1 R7.2 53.9,26.01 Q2.1
$1N397: length 15.6
  Top Layer w0.305: Q3.3 36.07,21.36 D3.2 36.09,13.74 35.05,12.7 RELAY3.2
$1N413: length 4.4
  Top Layer w0.305: R8.1 R9.2 37.02,26.81 Q3.1
$1N473: length 12.8
  Top Layer w0.305: U2.1 70.79,55.35 71.5,55.35 71.64,55.49 C5.1
$1N474: length 13.1
  Top Layer w0.305: C5.2 69.58,57.01 69.42,56.84 68.4,56.84 68.25,56.69 68.25,55.35 U2.3
$1N484: length 12
  Top Layer w0.305: C6.2 66.96,67.3 U2.4
$1N485: length 12.6
  Top Layer w0.305: C6.1 64.88,57.6 65.2,57.28 65.63,57.28 65.76,57.15 65.76,55.4 U2.5
$1N486: length 50.5
  Top Layer w0.305: v1(26.53,30.1) U3.28 ; v1(61.98,42.42) 61.98,42.72 R16.1
  Bottom Layer w0.305: v1(61.98,42.42) 61.98,30.99 61.09,30.1 v1(26.53,30.1)
$1N487: length 57
  Top Layer w0.305: U3.27 25.27,31.63 v1(25.27,29.59) ; R17.1 65.66,43.36 v1(65.66,32.77) ; v1(62.1,29.84) v1(65.66,29.84)
  Bottom Layer w0.305: v1(65.66,29.84) v1(65.66,32.77) ; v1(62.1,29.84) 61.34,29.08 25.78,29.08 v1(25.27,29.59)
$1N538: length 5.2
  Top Layer w0.305: C7.2 73.09,53.64 69.82,53.64 69.5,53.97 U2.2
$1N554: length 13.9
  Top Layer w0.305: U2.6 64.39,55.35 64.39,56.84 64.24,57 62.51,57 62.24,57.26 C8.1
$1N573: length 17.4
  Top Layer w0.305: DB1.2 79.66,37.24 80.01,37.59 80.01,41.02 79.76,41.27 77.47,41.27 77.22,41.53 77.22,43.43 76.91,43.74 R5.2
$1N574: length 14.6
  Top Layer w0.305: DB1.3 78.57,40 67.82,40 67.56,40.26 R6.2
$1N575: length 5
  Top Layer w0.305: U2.14 68.23,47.62 68.38,47.47 69.47,47.47 69.72,47.22 69.72,45.8 R5.1
$1N576: length 4.1
  Top Layer w0.305: U2.13 66.96,47.32 67.13,47.14 67.44,47.14 67.56,47.02 R6.1
$1N1782: length 15.8
  Top Layer w0.305: RELAY4.2 18.8,12.7 19.58,13.49 D4.2 19.58,23.61 Q4.3
$1N1818: length 4
  Top Layer w0.305: R15.1 R18.2 20.51,27.32 Q4.1
$1N1835: length 3.3
  Top Layer w0.305: R3.2 LED1.1

## Copper pours and planes (outline as drawn; the poured copper is in the pictures)
+3V3 on Top Layer: 19.56,63.25 54.1,63.25 54.1,56.9 19.56,56.9
+3V3 on Top Layer: 70.35,54.56 76.13,54.56 76.13,48.36 70.35,48.36
+3V3 on Top Layer: 37.34,52.98 51.12,52.98 51.12,48.26 37.34,48.26
+5V on Top Layer: 6.6,62.74 22.35,62.74 22.35,57.4 6.6,57.4
GND on Top Layer: -7.87,79.25 107.7,79.25 107.7,-17.15 -7.87,-17.15
GND on Bottom Layer: -5.84,84.58 121.67,84.58 121.67,-33.27 -5.84,-33.27

Small or netless copper shapes (teardrops, artwork), in the pictures only: 185 on Top Layer, 13 on Bottom Layer

## Text on the board
Top Silkscreen Layer: TMS | TDI | TCK | TDO | 1N108 | 1N109 | 6105123192
